# Altium schematic sheet Power.SchDoc: Power and Mechanical
size Letter; DrawnBy: J.-F. Cliche & Adam Gilbert; Engineer: J.-F. Cliche; DocumentNumber: 4; Revision: Rev2; SheetNumber: 4; SheetTotal: 5; ProjectTitle: DAN Squid Controller
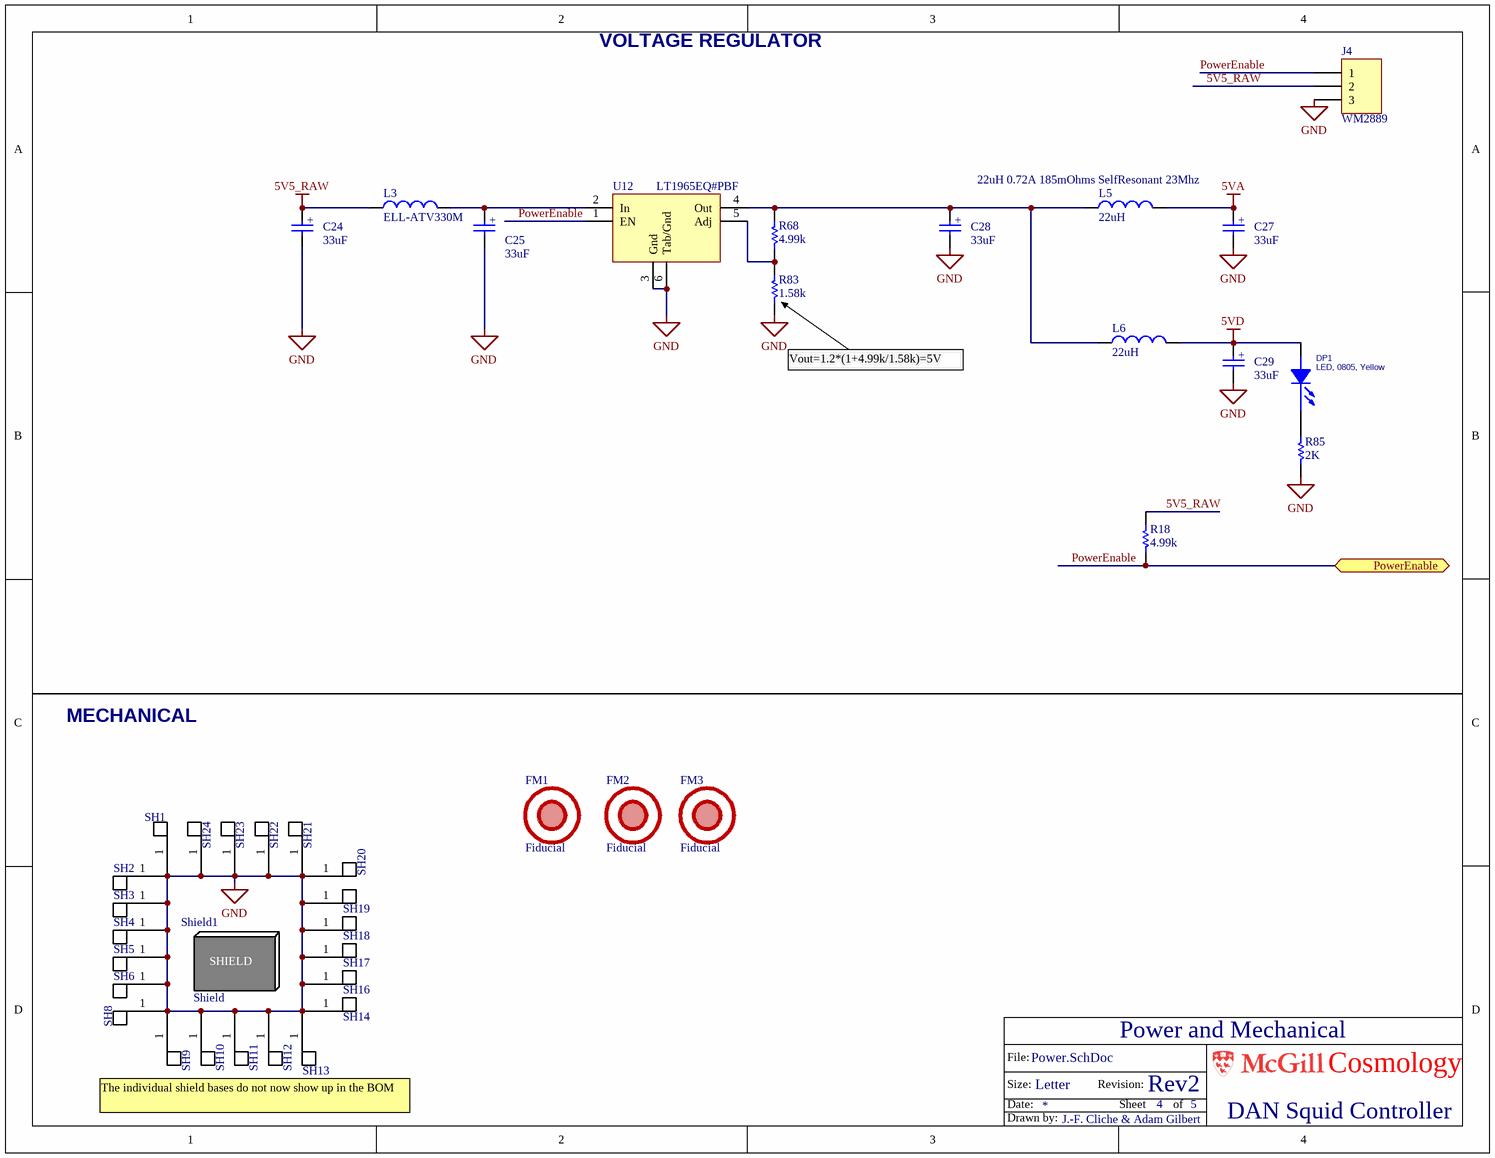
[diagram p0: Power.SchDoc]

## Parts
C24  33uF  [TCASE-D]
C25  33uF  [TCASE-D]
C27  33uF  [TCASE-D]
C28  33uF  [TCASE-D]
C29  33uF  [TCASE-D]
DP1  LED, 0805, Yellow  [0805L]
FM1  Fiducial  [Fiducial_mark]  (no BOM)
FM2  Fiducial  [Fiducial_mark]  (no BOM)
FM3  Fiducial  [Fiducial_mark]  (no BOM)
J4  WM2889  [HDR1X3_MolexVertical]
L3  ELL-ATV330M  [ELLATV]
L5  22uH  PartConstraints: 22uH 0.72A 185mOhms SelfResonant 23Mhz  [SRR4028]
L6  22uH  [SRR4028]
R18  4.99k  [0603]
R68  4.99k  [0603]
R83  1.58k  [0603]
R85  2k  [0603]
SH1  LeaderTech 20S-CBS-2x0.5x0.2 - DIVIDE QUANITY REQURIED BY 10!  [SHIELD BASE CORNER]  (value not drawn)  (no BOM)
SH2  LeaderTech 20S-CBS-2x0.5x0.2 - DIVIDE QUANITY REQURIED BY 10!  [SHIELD BASE]  (value not drawn)  (no BOM)
SH3  LeaderTech 20S-CBS-2x0.5x0.2 - DIVIDE QUANITY REQURIED BY 10!  [SHIELD BASE]  (value not drawn)  (no BOM)
SH4  LeaderTech 20S-CBS-2x0.5x0.2 - DIVIDE QUANITY REQURIED BY 10!  [SHIELD BASE]  (value not drawn)  (no BOM)
SH5  LeaderTech 20S-CBS-2x0.5x0.2 - DIVIDE QUANITY REQURIED BY 10!  [SHIELD BASE]  (value not drawn)  (no BOM)
SH6  LeaderTech 20S-CBS-2x0.5x0.2 - DIVIDE QUANITY REQURIED BY 10!  [SHIELD BASE]  (value not drawn)  (no BOM)
SH8  LeaderTech 20S-CBS-2x0.5x0.2 - DIVIDE QUANITY REQURIED BY 10!  [SHIELD BASE CORNER]  (value not drawn)  (no BOM)
SH9  LeaderTech 20S-CBS-2x0.5x0.2 - DIVIDE QUANITY REQURIED BY 10!  [SHIELD BASE]  (value not drawn)  (no BOM)
SH10  LeaderTech 20S-CBS-2x0.5x0.2 - DIVIDE QUANITY REQURIED BY 10!  [SHIELD BASE]  (value not drawn)  (no BOM)
SH11  LeaderTech 20S-CBS-2x0.5x0.2 - DIVIDE QUANITY REQURIED BY 10!  [SHIELD BASE]  (value not drawn)  (no BOM)
SH12  LeaderTech 20S-CBS-2x0.5x0.2 - DIVIDE QUANITY REQURIED BY 10!  [SHIELD BASE]  (value not drawn)  (no BOM)
SH13  LeaderTech 20S-CBS-2x0.5x0.2 - DIVIDE QUANITY REQURIED BY 10!  [SHIELD BASE CORNER]  (value not drawn)  (no BOM)
SH14  LeaderTech 20S-CBS-2x0.5x0.2 - DIVIDE QUANITY REQURIED BY 10!  [SHIELD BASE]  (value not drawn)  (no BOM)
SH16  LeaderTech 20S-CBS-2x0.5x0.2 - DIVIDE QUANITY REQURIED BY 10!  [SHIELD BASE]  (value not drawn)  (no BOM)
SH17  LeaderTech 20S-CBS-2x0.5x0.2 - DIVIDE QUANITY REQURIED BY 10!  [SHIELD BASE]  (value not drawn)  (no BOM)
SH18  LeaderTech 20S-CBS-2x0.5x0.2 - DIVIDE QUANITY REQURIED BY 10!  [SHIELD BASE]  (value not drawn)  (no BOM)
SH19  LeaderTech 20S-CBS-2x0.5x0.2 - DIVIDE QUANITY REQURIED BY 10!  [SHIELD BASE]  (value not drawn)  (no BOM)
SH20  LeaderTech 20S-CBS-2x0.5x0.2 - DIVIDE QUANITY REQURIED BY 10!  [SHIELD BASE CORNER]  (value not drawn)  (no BOM)
SH21  LeaderTech 20S-CBS-2x0.5x0.2 - DIVIDE QUANITY REQURIED BY 10!  [SHIELD BASE]  (value not drawn)  (no BOM)
SH22  LeaderTech 20S-CBS-2x0.5x0.2 - DIVIDE QUANITY REQURIED BY 10!  [SHIELD BASE]  (value not drawn)  (no BOM)
SH23  LeaderTech 20S-CBS-2x0.5x0.2 - DIVIDE QUANITY REQURIED BY 10!  [SHIELD BASE]  (value not drawn)  (no BOM)
SH24  LeaderTech 20S-CBS-2x0.5x0.2 - DIVIDE QUANITY REQURIED BY 10!  [SHIELD BASE]  (value not drawn)  (no BOM)
Shield1  Shield
U12  LT1965EQ#PBF  [D2-PAK-6_LT3080]

## Ports
PowerEnable

## Nets
5V5_RAW: C24.1 J4.2 L3.1 R18.2
5VA: C27.1 L5.2
5VD: C29.1 DP1.1(ANODE) L6.2
GND: C24.2 C25.2 C27.2 C28.2 C29.2 J4.3 R83.1 R85.2 SH1.1 SH2.1 SH3.1 SH4.1 SH5.1 SH6.1 SH8.1 SH9.1 SH10.1 SH11.1 SH12.1 SH13.1 SH14.1 SH16.1 SH17.1 SH18.1 SH19.1 SH20.1 SH21.1 SH22.1 SH23.1 SH24.1 U12.3(Gnd) U12.6(Tab/Gnd)
PowerEnable: J4.1 R18.1 U12.1(EN) ; port PowerEnable
NetC25_1: C25.1 L3.2 U12.2(In)
NetC28_1: C28.1 L5.1 L6.1 R68.2 U12.4(Out)
NetDP1_2: DP1.2(CATHODE) R85.1
NetR68_1: R68.1 R83.2 U12.5(Adj)

## Notes on the sheet
- VOLTAGE REGULATOR
- (near R83) Vout=1.2*(1+4.99k/1.58k)=5V
- MECHANICAL
- The individual shield bases do not now show up in the BOM
- File:
- Size:
- Date:
- Letter
- Revision:
- Sheet
- of
- Cosmology
- Drawn by:
- (in symbol SHIELD 20S-CBS-3x2.5x0.2) SHIELD
- (in symbol Tantalum) +

## Library data of the parts
C24 C25 C27-C29 = Tantalum: CAP TANT CASE-D; Manufacturer: Generic; Part Constraints: CAP TANT 33UF 16V 20% 2917; Voltage: 16V; ESR: 100mOhms; Footprint: D; Value: 33uF; Supplier 1: Digi-Key
  C24: Supplier Part Number 1: 399-4738-2-ND; Supplier 2: Digi-Key; Supplier Part Number 2: 399-4738-1-ND
  C25 C27-C29: Supplier Part Number 1: 399-4738-1-ND
DP1 = LED, yellow, 0805, 2mA: LED; Part Constraints: 511-1293-1-ND; Supplier 1: Digi-Key; Supplier Part Number 1: 511-1293-1-ND
J4 = Header 3: 3-Pin 0.1" header; Manufacturer: Digikey; Part Constraints: WM2889; Supplier 1: Molex; Supplier Part Number 1: WM2889-ND
L3 = ELL-ATV330M: 33uH 1.8A inductor 10mmx10mm; Manufacturer: Panasonic - ECG; Inductance: 33µH; Type: Ferrite Core; Tolerance: ±20%; Shielding: Shielded; DC Resistance (DCR): 62 mOhm; Frequency - Test: 100kHz; RoHS: RoHS Compliant; Category: Inductors, Coils, Chokes; Stock 1: 6281; Pricing 1: 1=2.28, 10=2.15, 50=2.0154, 100=1.8811 (CAD); Current: 1.8A; Current - Saturation: -; Current - Temperature Rise: -; Q @ Freq: -; Frequency - Self Resonant: -; Applications: General Purpose; Material - Core: -; Package / Case: 0.394" L x 0.394" W x 0.177" H (10.00mm x 10.00mm x 4.50mm); Mounting Type: Surface Mount; Packaging: Cut Tape (CT); Operating Temperature: -; ComponentLink1URL: http://industrial.panasonic.com/www-cgi/jvcr13pz.cgi?E+PZ+2+AGM0010+0+4+WW; ComponentLink1Description: http://industrial.panasonic.com/www-cgi/jvcr13pz.cgi?E+PZ+2+AGM0010+0+4+WW; Supplier 1: Digi-Key; Supplier Part Number 1: PCD1754CT-ND; Part Constraints: ELL-ATV330M
L5 = InductorSRR4028: =PartConstraints; Manufacturer: Bourns; Part Constraints: SRR4028-220YCT-ND; Resistance: 185mOhms; CurrentRating: 0.72A; SRF: SelfResonant 23Mhz; Inductance: 22uH; Supplier 1: Digi-Key; Supplier Part Number 1: SRR4028-220YCT-ND
L6 = InductorSRR4028: =PartConstraints; Manufacturer: Bourns; PartConstraints: 22uH 0.72A 185mOhms SelfResonant 23Mhz; Part Constraints: SRR4028-220YCT-ND; Resistance: 185mOhms; CurrentRating: 0.72A; SRF: SelfResonant 23Mhz; Inductance: 22uH; Supplier 1: Digi-Key; Supplier Part Number 1: SRR4028-220YCT-ND
R18 R68 = Res0603: RES 0603; Manufacturer: Generic; Part constraints: RES 4.99K OHM 1/10W 1% 0603 SMD; Manufacturer Part Number 1: e.g CRCW0603 series; Value: 4.99k; Supplier 1: Digi-Key; Supplier Part Number 1: 541-4.99KHCT-ND
R83 = Res0603: RES 0603; Manufacturer: Generic; Part constraints: RES 1.58K OHM 1/10W 1% 0603 SMD; Manufacturer Part Number 1: e.g CRCW0603 series; Value: 1.58k; Supplier 1: Digi-Key; Supplier Part Number 1: 541-1.58KHCT-ND
R85 = Res0603: RES 0603; Manufacturer: Generic; Part constraints: RES 2.00K OHM 1/10W 1% 0603 SMD; Manufacturer Part Number 1: e.g CRCW0603 series; Value: 2K; Supplier 1: Digi-Key; Supplier Part Number 1: 541-2.00KHCT-ND
SH1-SH6 SH8-SH14 SH16-SH24 = ShieldBase: Part Constraints: 20S-CBS-3x2.5x0.2  (divide quantity by 22); Manufacturer: LeaderTech; Supplier 1: LeaderTech; Supplier Part Number 1: 20S-CBS-3x2.5x0.2  (divide quantity by 22)
Shield1 = SHIELD 20S-CBS-3x2.5x0.2: 20S-CBSA-3x2.5x0.2 (assembled fence and cover); Manufacturer: Leadertech; Supplier 1: Leadertech; Supplier Part Number 1: 20S-CBSA-3x2.5x0.2 (assembled fence and cover); Part Constraints: 20S-CBSA-3x2.5x0.2 (assembled fence and cover)
U12 = LT1965EQ: Low dropout regulator, single resistor, 1.1A; Manufacturer 1: Linear Technology; Description 1: IC REG LDO ADJ 1.1A 5-DD; Category 1: Integrated Circuits (ICs); Regulator Topology: Positive Adjustable; Voltage - Output: 1.2 V ~ 19.5 V; Voltage - Input: 1.8 V ~ 20 V; Voltage - Dropout (Typical): 0.31V @ 1.1A; Number of Regulators: 1; Current - Limit (Min): 1.2A; Supplier 1: Digi-Key; Manufacturer Part Number 1: LT1965EQ#PBF; RoHS 1: RoHS Compliant; Stock 1: 1301; Pricing 1: 1=4.88, 25=3.486, 100=2.8753 (CAD); Current - Output: 1.1A; Operating Temperature: -40°C ~ 125°C; Mounting Type: Surface Mount; Package / Case: TO-263-6, D²Pak (5 Leads + Tab), TO-263BA; Supplier Device Package: D2PAK-5; Packaging: Tube; ComponentLink1URL: http://www.linear.com/docs/25320; ComponentLink1Description: http://www.linear.com/docs/25320; Supplier Part Number 1: LT1965EQ#PBF-ND